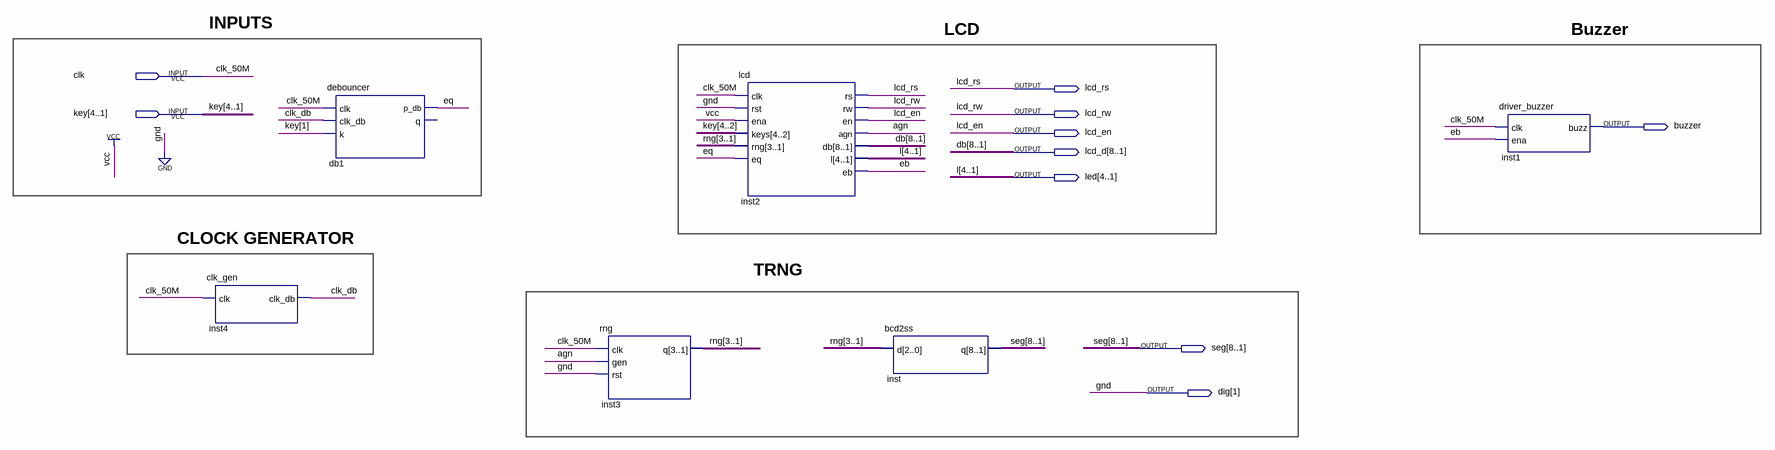
[diagram p0: schematic sheet]
// Quartus schematic main.bdf as structural Verilog: 6 symbols, 10 pins
module main (
  input  clk,
  input  [4:1] key,
  output lcd_rs,
  output lcd_rw,
  output buzzer,
  output lcd_en,
  output [8:1] lcd_d,
  output [4:1] led,
  output [8:1] seg,
  output [1:1] dig
);

  wire agn, clk_db, eb, eq;
  wire [3:1] rng;

  clk_gen inst4 (.clk(clk), .clk_db(clk_db));
  debouncer db1 (.clk(clk), .clk_db(clk_db), .k(key[1]), .p_db(eq));  // open: q
  rng inst3 (.clk(clk), .gen(agn), .rst(1'b0), .q(rng));
  lcd inst2 (
    .clk(clk), .rst(1'b0), .ena(1'b1), .keys(key[4:2]), .rng(rng), .eq(eq), .rs(lcd_rs), .rw(lcd_rw),
    .en(lcd_en), .agn(agn), .db(lcd_d), .l(led), .eb(eb));
  bcd2ss inst (.d(rng), .q(seg));
  driver_buzzer inst1 (.clk(clk), .ena(eb), .buzz(buzzer));

  assign dig[1] = 1'b0;

  // Other names for the same wires on the sheet: clk_50M = clk; db[8:1] = lcd_d; l[4:1] = led

  // Notes on the sheet:
  //   INPUTS
  //   LCD
  //   Buzzer
  //   CLOCK GENERATOR
  //   TRNG
endmodule
